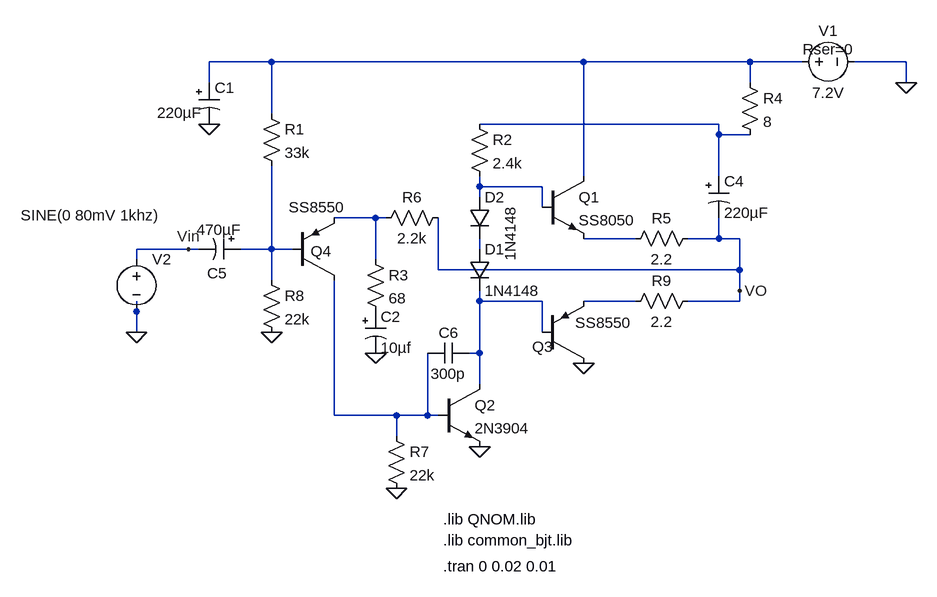
[diagram p0: schematic sm0vpo.asc]
sm0vpo.asc, the LTspice schematic file:
Version 4
SHEET 1 880 680
WIRE -256 -320 -352 -320
WIRE 224 -320 -256 -320
WIRE 480 -320 224 -320
WIRE 560 -320 480 -320
WIRE 720 -320 640 -320
WIRE -352 -288 -352 -320
WIRE 480 -288 480 -320
WIRE 720 -288 720 -320
WIRE -256 -240 -256 -320
WIRE 432 -224 64 -224
WIRE 432 -208 432 -224
WIRE 480 -208 432 -208
WIRE 224 -144 224 -320
WIRE 432 -144 432 -208
WIRE 64 -128 64 -144
WIRE 160 -128 64 -128
WIRE 64 -112 64 -128
WIRE 160 -96 160 -128
WIRE -96 -80 -160 -80
WIRE -80 -80 -96 -80
WIRE 304 -48 224 -48
WIRE 432 -48 432 -80
WIRE 432 -48 384 -48
WIRE 464 -48 432 -48
WIRE -384 -32 -464 -32
WIRE -368 -32 -384 -32
WIRE -256 -32 -256 -160
WIRE -256 -32 -304 -32
WIRE -224 -32 -256 -32
WIRE 64 -32 64 -48
WIRE -464 -16 -464 -32
WIRE -96 -16 -96 -80
WIRE 0 0 0 -80
WIRE 464 0 464 -48
WIRE 464 0 0 0
WIRE -256 16 -256 -32
WIRE 464 32 464 0
WIRE 64 48 64 32
WIRE 160 48 64 48
WIRE 304 48 224 48
WIRE 464 48 464 32
WIRE 464 48 384 48
WIRE -464 64 -464 48
WIRE -464 96 -464 64
WIRE 160 96 160 48
WIRE 64 128 64 48
WIRE 64 128 48 128
WIRE 64 176 64 128
WIRE -160 224 -160 16
WIRE -64 224 -160 224
WIRE -16 224 -16 128
WIRE -16 224 -64 224
WIRE 0 224 -16 224
WIRE -64 256 -64 224
FLAG -464 96 0
FLAG 224 144 0
FLAG 64 272 0
FLAG -352 -224 0
FLAG 720 -288 0
FLAG -64 336 0
FLAG -256 96 0
FLAG -96 128 0
FLAG 464 32 VO
FLAG -384 -32 Vin
SYMBOL npn 160 -144 R0
SYMATTR InstName Q1
SYMATTR Value SS8050
SYMBOL voltage 544 -320 R270
WINDOW 0 32 56 VTop 2
WINDOW 3 -32 56 VBottom 2
WINDOW 123 0 0 Left 2
WINDOW 39 4 56 VTop 2
SYMATTR InstName V1
SYMATTR Value 7.2V
SYMATTR SpiceLine Rser=0
SYMBOL voltage -464 -32 R0
WINDOW 123 0 0 Left 2
WINDOW 39 0 0 Left 2
WINDOW 3 -178 -52 Left 2
SYMATTR InstName V2
SYMATTR Value SINE(0 80mV 1khz)
SYMBOL res 464 -304 R0
SYMATTR InstName R4
SYMATTR Value 8
SYMATTR SpiceLine tol=1% pwr=1
SYMBOL res 48 -240 R0
SYMATTR InstName R2
SYMATTR Value 2.4k
SYMATTR SpiceLine tol=1% pwr=1
SYMBOL npn 0 176 R0
SYMATTR InstName Q2
SYMATTR Value 2N3904
SYMBOL pnp 160 144 M180
WINDOW 0 -15 26 Left 2
WINDOW 3 51 63 Left 2
SYMATTR InstName Q3
SYMATTR Value SS8550
SYMBOL diode 48 -32 R0
SYMATTR InstName D1
SYMATTR Value 1N4148
SYMBOL diode 48 -112 R0
WINDOW 3 63 13 VRight 2
SYMATTR InstName D2
SYMATTR Value 1N4148
SYMBOL res -80 240 R0
SYMATTR InstName R7
SYMATTR Value 22k
SYMATTR SpiceLine tol=1% pwr=1
SYMBOL polcap 416 -144 R0
SYMATTR InstName C4
SYMATTR Value 220µF
SYMATTR SpiceLine V=35 Irms=1.2 Rser=0.08 Lser=0
SYMBOL polcap -304 -48 R90
WINDOW 0 69 36 VBottom 2
WINDOW 3 -29 33 VTop 2
SYMATTR InstName C5
SYMATTR Value 470µF
SYMATTR SpiceLine V=100 Irms=10m Rser=0.01 Lser=0
SYMBOL polcap -368 -288 R0
WINDOW 3 -64 46 Left 2
SYMATTR InstName C1
SYMATTR Value 220µF
SYMATTR SpiceLine V=35 Irms=750m Rser=0.0016 Lser=0
SYMBOL res 288 -32 R270
WINDOW 0 32 56 VTop 2
WINDOW 3 0 56 VBottom 2
SYMATTR InstName R5
SYMATTR Value 2.2
SYMATTR SpiceLine tol=1% pwr=1
SYMBOL res 288 64 R270
WINDOW 0 32 56 VTop 2
WINDOW 3 0 56 VBottom 2
SYMATTR InstName R9
SYMATTR Value 2.2
SYMATTR SpiceLine tol=1% pwr=1
SYMBOL cap 48 112 R90
WINDOW 0 0 32 VBottom 2
WINDOW 3 32 32 VTop 2
SYMATTR InstName C6
SYMATTR Value 300p
SYMATTR SpiceLine V=10 Irms=0 Rser=0.009 Lser=0
SYMBOL pnp -224 16 M180
WINDOW 0 28 45 Left 2
WINDOW 3 -6 112 Left 2
SYMATTR InstName Q4
SYMATTR Value SS8550
SYMBOL res -272 -256 R0
SYMATTR InstName R1
SYMATTR Value 33k
SYMATTR SpiceLine tol=1% pwr=1
SYMBOL res -272 0 R0
SYMATTR InstName R8
SYMATTR Value 22k
SYMATTR SpiceLine tol=1% pwr=1
SYMBOL res -112 -32 R0
SYMATTR InstName R3
SYMATTR Value 68
SYMATTR SpiceLine tol=1% pwr=1
SYMBOL polcap -112 64 R0
SYMATTR InstName C2
SYMATTR Value 10µf
SYMATTR SpiceLine V=35 Irms=1.2 Rser=0.08 Lser=0
SYMBOL res -96 -64 R270
WINDOW 0 32 56 VTop 2
WINDOW 3 0 56 VBottom 2
SYMATTR InstName R6
SYMATTR Value 2.2k
SYMATTR SpiceLine tol=1% pwr=1
TEXT 8 416 Left 2 !.lib common_bjt.lib
TEXT 8 456 Left 2 !.tran 0 0.02 0.01
TEXT 8 384 Left 2 !.lib QNOM.lib

The netlist it stands for:
* sm0vpo.asc
Q1 N001 N003 N005 0 SS8050
V1 N001 0 7.2V Rser=0
V2 Vin 0 SINE(0 80mV 1khz)
R4 N001 N002 8 tol=1% pwr=1
R2 N002 N003 2.4k tol=1% pwr=1
Q2 N008 N010 0 0 2N3904
Q3 0 N008 N009 0 SS8550
D1 N007 N008 1N4148
D2 N003 N007 1N4148
R7 N010 0 22k tol=1% pwr=1
C4 N002 VO 220µF V=35 Irms=1.2 Rser=0.08 Lser=0
C5 N006 Vin 470µF V=100 Irms=10m Rser=0.01 Lser=0
C1 N001 0 220µF V=35 Irms=750m Rser=0.0016 Lser=0
R5 N005 VO 2.2 tol=1% pwr=1
R9 N009 VO 2.2 tol=1% pwr=1
C6 N008 N010 300p V=10 Irms=0 Rser=0.009 Lser=0
Q4 N010 N006 N004 0 SS8550
R1 N001 N006 33k tol=1% pwr=1
R8 N006 0 22k tol=1% pwr=1
R3 N004 P001 68 tol=1% pwr=1
C2 P001 0 10µf V=35 Irms=1.2 Rser=0.08 Lser=0
R6 N004 VO 2.2k tol=1% pwr=1
.model D D
.lib standard.dio
.model NPN NPN
.model PNP PNP
.lib standard.bjt
.lib common_bjt.lib
.tran 0 0.02 0.01
.lib QNOM.lib
.backanno
.end